# Altium project WiCam.PrjPcb
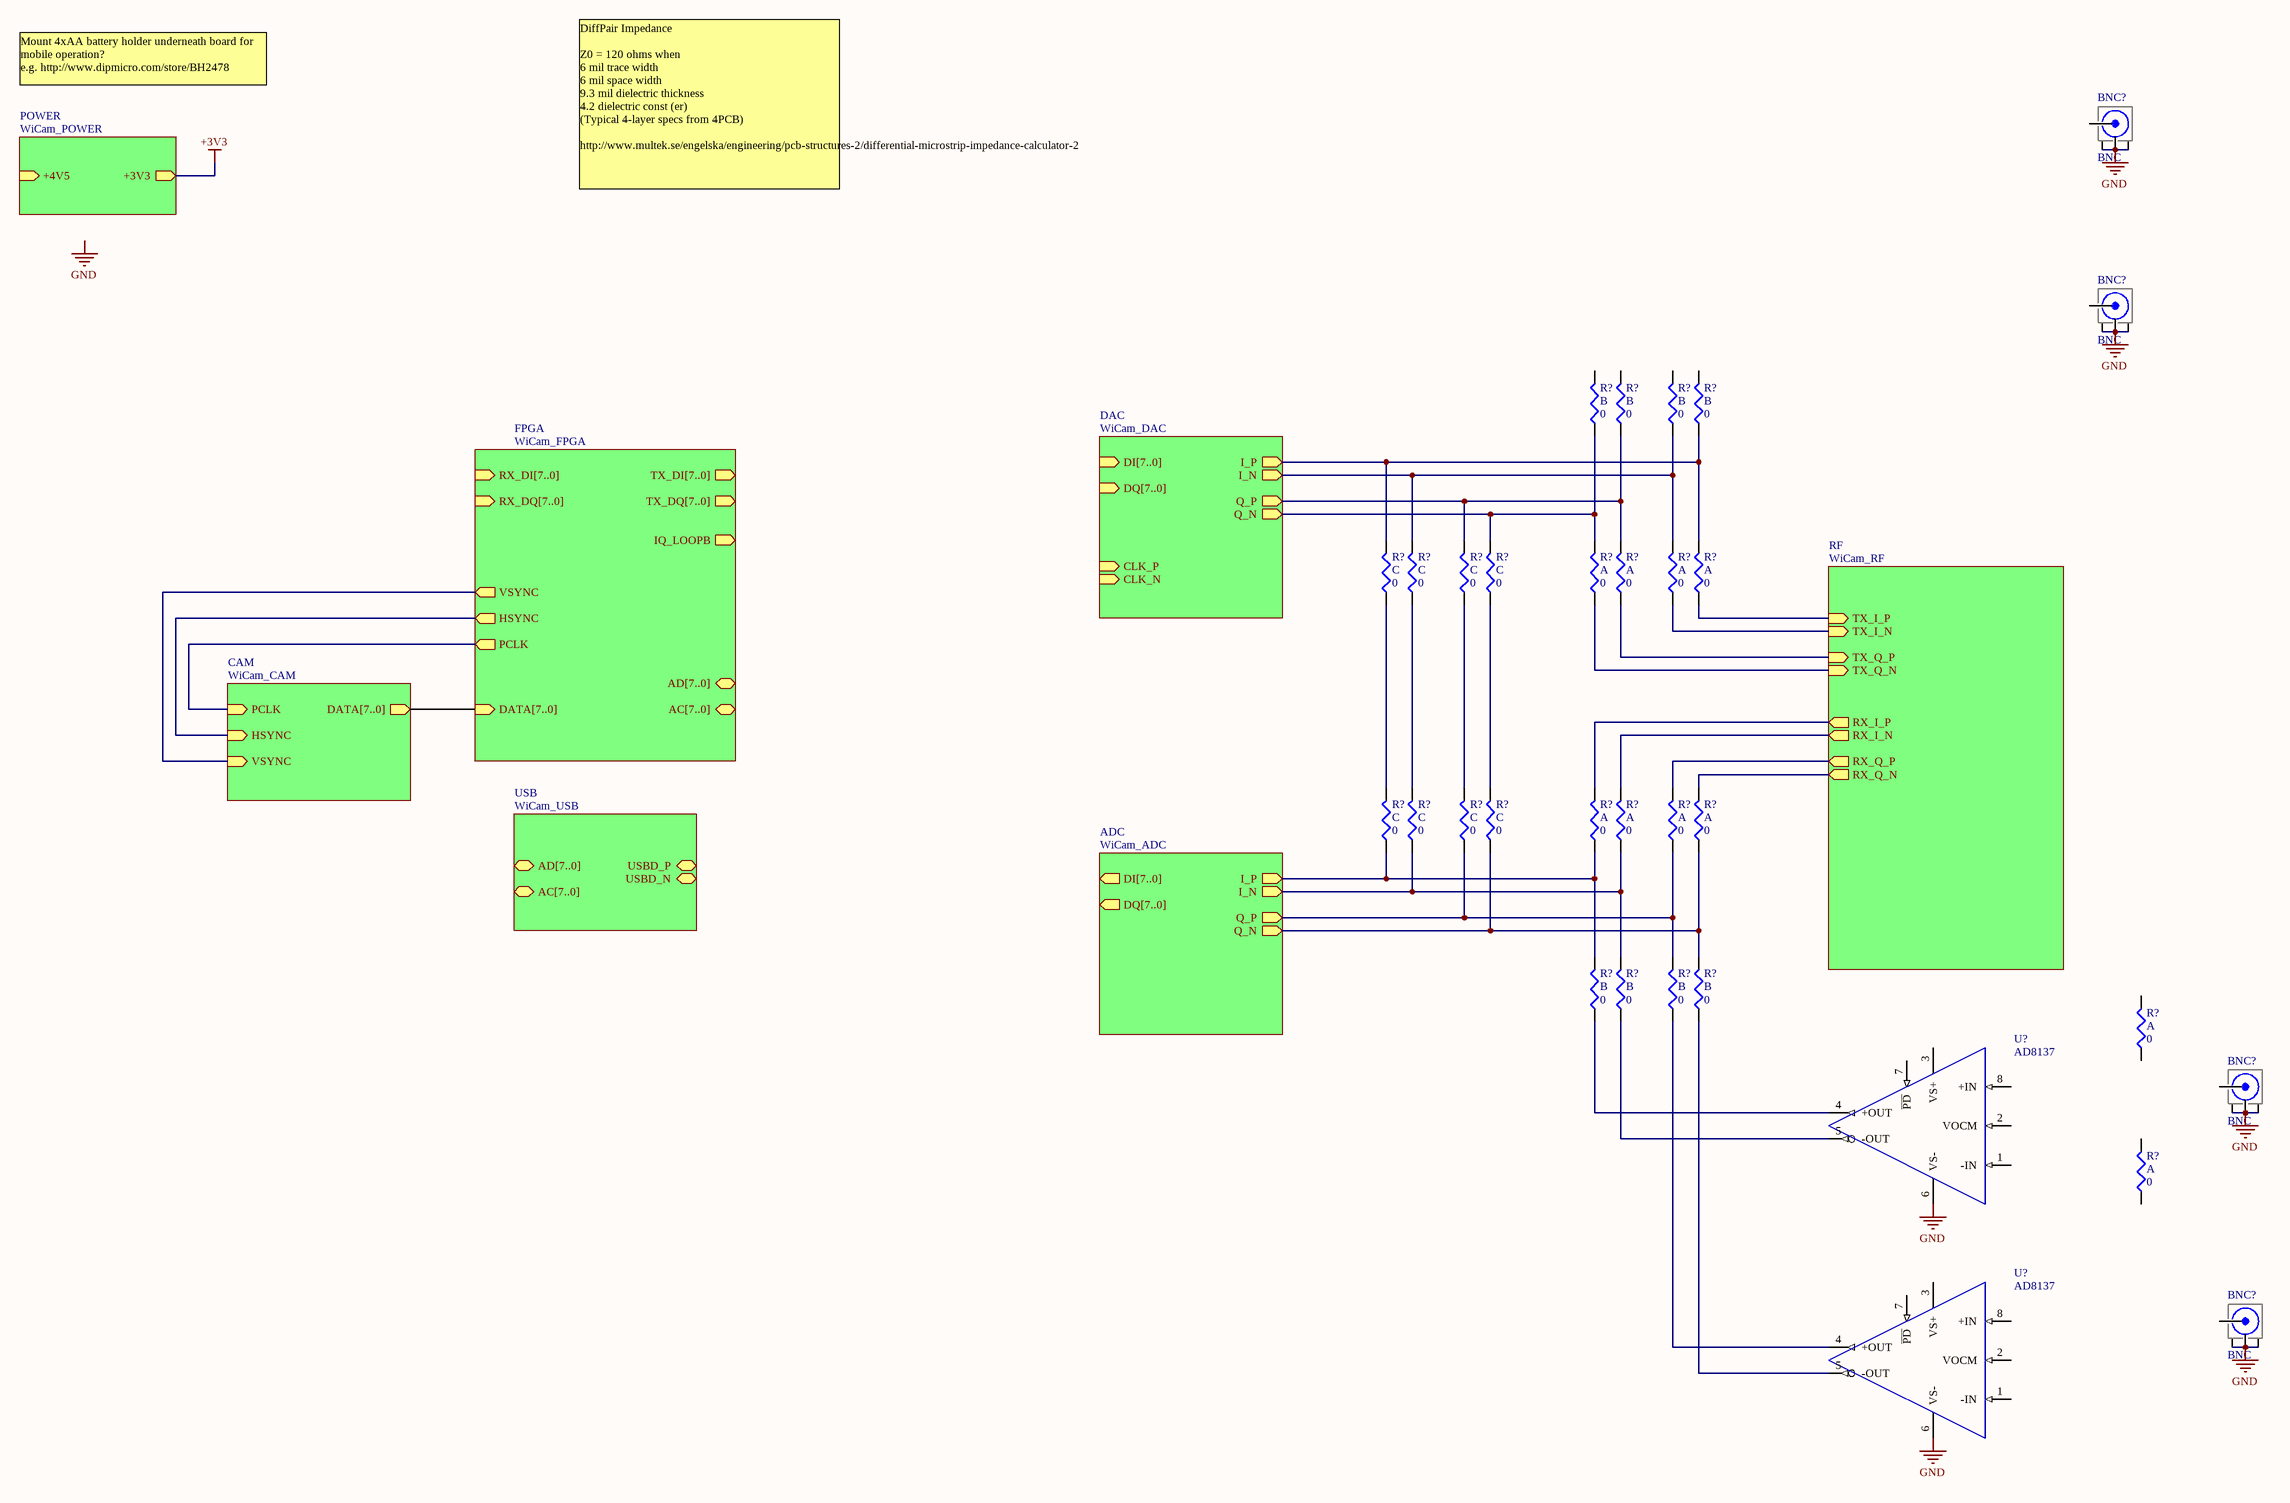
[diagram p0: WiCam.SchDoc]
8 sheets, 34 parts. Net scope: hierarchical (ports join the sheet entries above them; power ports are global).
Sheets:
  WiCam.SchDoc
    RF = WiCam_RF.SchDoc
    ADC = WiCam_ADC.SchDoc
    FPGA = WiCam_FPGA.SchDoc
    USB = WiCam_USB.SchDoc
    CAM = WiCam_CAM.SchDoc
    DAC = WiCam_DAC.SchDoc
    POWER = WiCam_POWER.SchDoc

## Sheet WiCam.SchDoc
size C

### Parts
(Parts that share a designator on the sheet are numbered #1, #2 ... from top to bottom, then left to right.)
BNC?#1  BNC  [BNC RA]
BNC?#2  BNC  [BNC RA]
BNC?#3  BNC  [BNC RA]
BNC?#4  BNC  [BNC RA]
R?#1  B  value 0  [J1-0603]
R?#2  B  value 0  [J1-0603]
R?#3  B  value 0  [J1-0603]
R?#4  B  value 0  [J1-0603]
R?#5  C  value 0  [J1-0603]
R?#6  C  value 0  [J1-0603]
R?#7  C  value 0  [J1-0603]
R?#8  C  value 0  [J1-0603]
R?#9  A  value 0  [J1-0603]
R?#10  A  value 0  [J1-0603]
R?#11  A  value 0  [J1-0603]
R?#12  A  value 0  [J1-0603]
R?#13  C  value 0  [J1-0603]
R?#14  C  value 0  [J1-0603]
R?#15  C  value 0  [J1-0603]
R?#16  C  value 0  [J1-0603]
R?#17  A  value 0  [J1-0603]
R?#18  A  value 0  [J1-0603]
R?#19  A  value 0  [J1-0603]
R?#20  A  value 0  [J1-0603]
R?#21  B  value 0  [J1-0603]
R?#22  B  value 0  [J1-0603]
R?#23  B  value 0  [J1-0603]
R?#24  B  value 0  [J1-0603]
R?#25  A  value 0  [J1-0603]
R?#26  A  value 0  [J1-0603]
U?#1  AD8137  [ANALOG LFCSP_WD-8]
U?#2  AD8137  [ANALOG LFCSP_WD-8]

### Sub-sheets
ADC = WiCam_ADC: DI[7..0] (out), DQ[7..0] (out), I_P (out), Q_N (out), Q_P (out), I_N (out)
CAM = WiCam_CAM: DATA[7..0] (out), PCLK (in), HSYNC (in), VSYNC (in)
DAC = WiCam_DAC: I_P (out), Q_N (out), DI[7..0] (in), DQ[7..0] (in), CLK_P (in), CLK_N (in), Q_P (out), I_N (out)
FPGA = WiCam_FPGA: TX_DI[7..0] (out), TX_DQ[7..0] (out), RX_DI[7..0] (in), RX_DQ[7..0] (in), AD[7..0] (bidir), AC[7..0] (bidir), DATA[7..0] (in), PCLK (out), HSYNC (out), VSYNC (out), IQ_LOOPB (out)
POWER = WiCam_POWER: +4V5 (in), +3V3 (out)
RF = WiCam_RF: RX_I_P (out), RX_I_N (out), RX_Q_P (out), RX_Q_N (out), TX_I_P (in), TX_I_N (in), TX_Q_P (in), TX_Q_N (in)
USB = WiCam_USB: AD[7..0] (bidir), AC[7..0] (bidir), USBD_P (bidir), USBD_N (bidir)

### Nets
+3V3: sheet POWER/+3V3
GND: BNC?#1.2(SHELL) BNC?#1.S1 BNC?#1.S2 BNC?#2.2(SHELL) BNC?#2.S1 BNC?#2.S2 BNC?#3.2(SHELL) BNC?#3.S1 BNC?#3.S2 BNC?#4.2(SHELL) BNC?#4.S1 BNC?#4.S2 U?#1.6(VS-) U?#2.6(VS-)
NetR?#1_1: R?#1.1 R?#8.2 R?#9.2 ; sheet DAC/Q_N
NetR?#2_1: R?#2.1 R?#7.2 R?#10.2 ; sheet DAC/Q_P
NetR?#3_1: R?#3.1 R?#6.2 R?#11.2 ; sheet DAC/I_N
NetR?#4_1: R?#4.1 R?#5.2 R?#12.2 ; sheet DAC/I_P
NetR?#5_1: R?#5.1 R?#13.2
NetR?#6_1: R?#6.1 R?#14.2
NetR?#7_1: R?#7.1 R?#15.2
NetR?#8_1: R?#8.1 R?#16.2
NetR?#9_1: R?#9.1 ; sheet RF/TX_Q_N
NetR?#10_1: R?#10.1 ; sheet RF/TX_Q_P
NetR?#11_1: R?#11.1 ; sheet RF/TX_I_N
NetR?#12_1: R?#12.1 ; sheet RF/TX_I_P
NetR?#13_1: R?#13.1 R?#17.1 R?#21.2 ; sheet ADC/I_P
NetR?#14_1: R?#14.1 R?#18.1 R?#22.2 ; sheet ADC/I_N
NetR?#15_1: R?#15.1 R?#19.1 R?#23.2 ; sheet ADC/Q_P
NetR?#16_1: R?#16.1 R?#20.1 R?#24.2 ; sheet ADC/Q_N
NetR?#17_2: R?#17.2 ; sheet RF/RX_I_P
NetR?#18_2: R?#18.2 ; sheet RF/RX_I_N
NetR?#19_2: R?#19.2 ; sheet RF/RX_Q_P
NetR?#20_2: R?#20.2 ; sheet RF/RX_Q_N
NetR?#21_1: R?#21.1 U?#1.4(+OUT)
NetR?#22_1: R?#22.1 U?#1.5(-OUT)
NetR?#23_1: R?#23.1 U?#2.4(+OUT)
NetR?#24_1: R?#24.1 U?#2.5(-OUT)
(unnamed): sheet FPGA/PCLK, sheet CAM/PCLK
(unnamed): sheet FPGA/HSYNC, sheet CAM/HSYNC
(unnamed): sheet FPGA/VSYNC, sheet CAM/VSYNC

Not connected (* = marked no-connect by the designer): BNC?#1 1(SIGNAL); BNC?#2 1(SIGNAL); BNC?#3 1(SIGNAL); BNC?#4 1(SIGNAL); R?#1 2; R?#2 2; R?#3 2; R?#4 2; R?#25 1 2; R?#26 1 2; U?#1 1(-IN) 2(VOCM) 3(VS+) 7(~{PD}) 8(+IN); U?#2 1(-IN) 2(VOCM) 3(VS+) 7(~{PD}) 8(+IN)

### Buses and harness runs
bus sheet CAM/DATA[7..0] = sheet FPGA/DATA[7..0]

### Notes on the sheet
- Mount 4xAA battery holder underneath board for mobile operation?
  e.g. http://www.dipmicro.com/store/BH2478
- DiffPair Impedance
  Z0 = 120 ohms when
  6 mil trace width
  6 mil space width
  9.3 mil dielectric thickness
  4.2 dielectric const (er)
  (Typical 4-layer specs from 4PCB)
  http://www.multek.se/engelska/engineering/pcb-structures-2/differential-microstrip-impedance-calculator-2
- Labels drawn without touching a wire or pin: GND

### Library data of the parts
BNC?#1-BNC?#4 = BNC: BNC CONNECTOR
R?#1-R?#26 = Res3: Resistor; Published: 8-Jun-2000; LatestRevisionDate: 29-May-2009; LatestRevisionNote: IPC-7351 Footprint Added.; PackageReference: J1-0603; Publisher: Altium Limited; PackageDescription: Chip Resistor
U?#1 U?#2 = AD8137: AMP SE/DIFF IN DIFF OUT

## Sheet WiCam_RF.SchDoc
size B
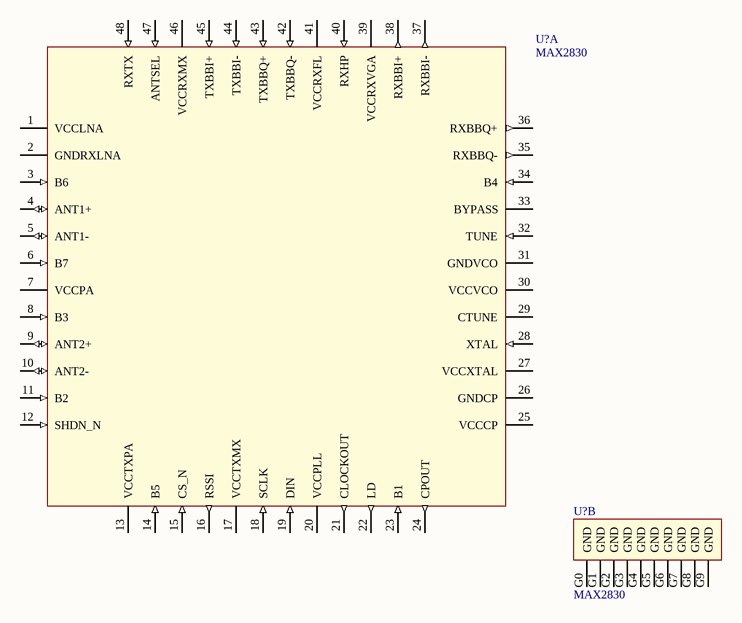
[diagram p1: WiCam_RF.SchDoc]

### Parts
(Parts that share a designator on the sheet are numbered #1, #2 ... from top to bottom, then left to right.)
U?#3  MAX2830  [MAXIM T4877-4]  (part A of 2)
U?#4  MAX2830  [MAXIM T4877-4]  (part B of 2)

### Nets

Not connected (* = marked no-connect by the designer): U?#3 1(VCCLNA) 2(GNDRXLNA) 3(B6) 4(ANT1+) 5(ANT1-) 6(B7) 7(VCCPA) 8(B3) 9(ANT2+) 10(ANT2-) 11(B2) 12(SHDN_N) 13(VCCTXPA) 14(B5) 15(CS_N) 16(RSSI) 17(VCCTXMX) 18(SCLK) 19(DIN) 20(VCCPLL) 21(CLOCKOUT) 22(LD) 23(B1) 24(CPOUT) 25(VCCCP) 26(GNDCP) 27(VCCXTAL) 28(XTAL) 29(CTUNE) 30(VCCVCO) 31(GNDVCO) 32(TUNE) 33(BYPASS) 34(B4) 35(RXBBQ-) 36(RXBBQ+) 37(RXBBI-) 38(RXBBI+) 39(VCCRXVGA) 40(RXHP) 41(VCCRXFL) 42(TXBBQ-) 43(TXBBQ+) 44(TXBBI-) 45(TXBBI+) 46(VCCRXMX) 47(ANTSEL) 48(RXTX); U?#4 G0(GND) G1(GND) G2(GND) G3(GND) G4(GND) G5(GND) G6(GND) G7(GND) G8(GND) G9(GND)

### Library data of the parts
U?#3 U?#4 = MAX2830: MAXIM MAX2830 2.4GHZ RXTX

## Sheet WiCam_ADC.SchDoc
size B
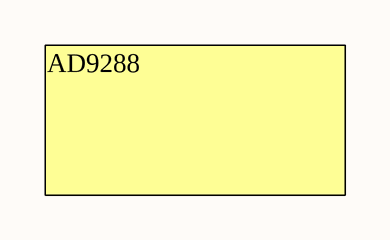
[diagram p2: WiCam_ADC.SchDoc]

### Notes on the sheet
- AD9288

## Sheet WiCam_FPGA.SchDoc
size B

## Sheet WiCam_USB.SchDoc
size B

## Sheet WiCam_CAM.SchDoc
size B

## Sheet WiCam_DAC.SchDoc
size B
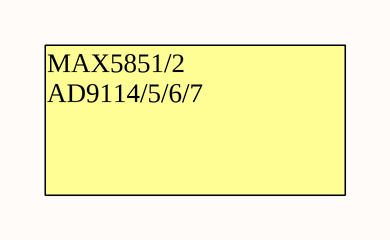
[diagram p3: WiCam_DAC.SchDoc]

### Notes on the sheet
- MAX5851/2
  AD9114/5/6/7

## Sheet WiCam_POWER.SchDoc
size B